# Altium schematic sheet Conn.SchDoc: Connectros
size 420 x 297 mm; Author: UA3REO; CompanyName: Wolf Team; Engineer: UA3REO; DocumentNumber: Connectors FRONT 7'; Revision: 0.1; SheetNumber: 3; SheetTotal: 6
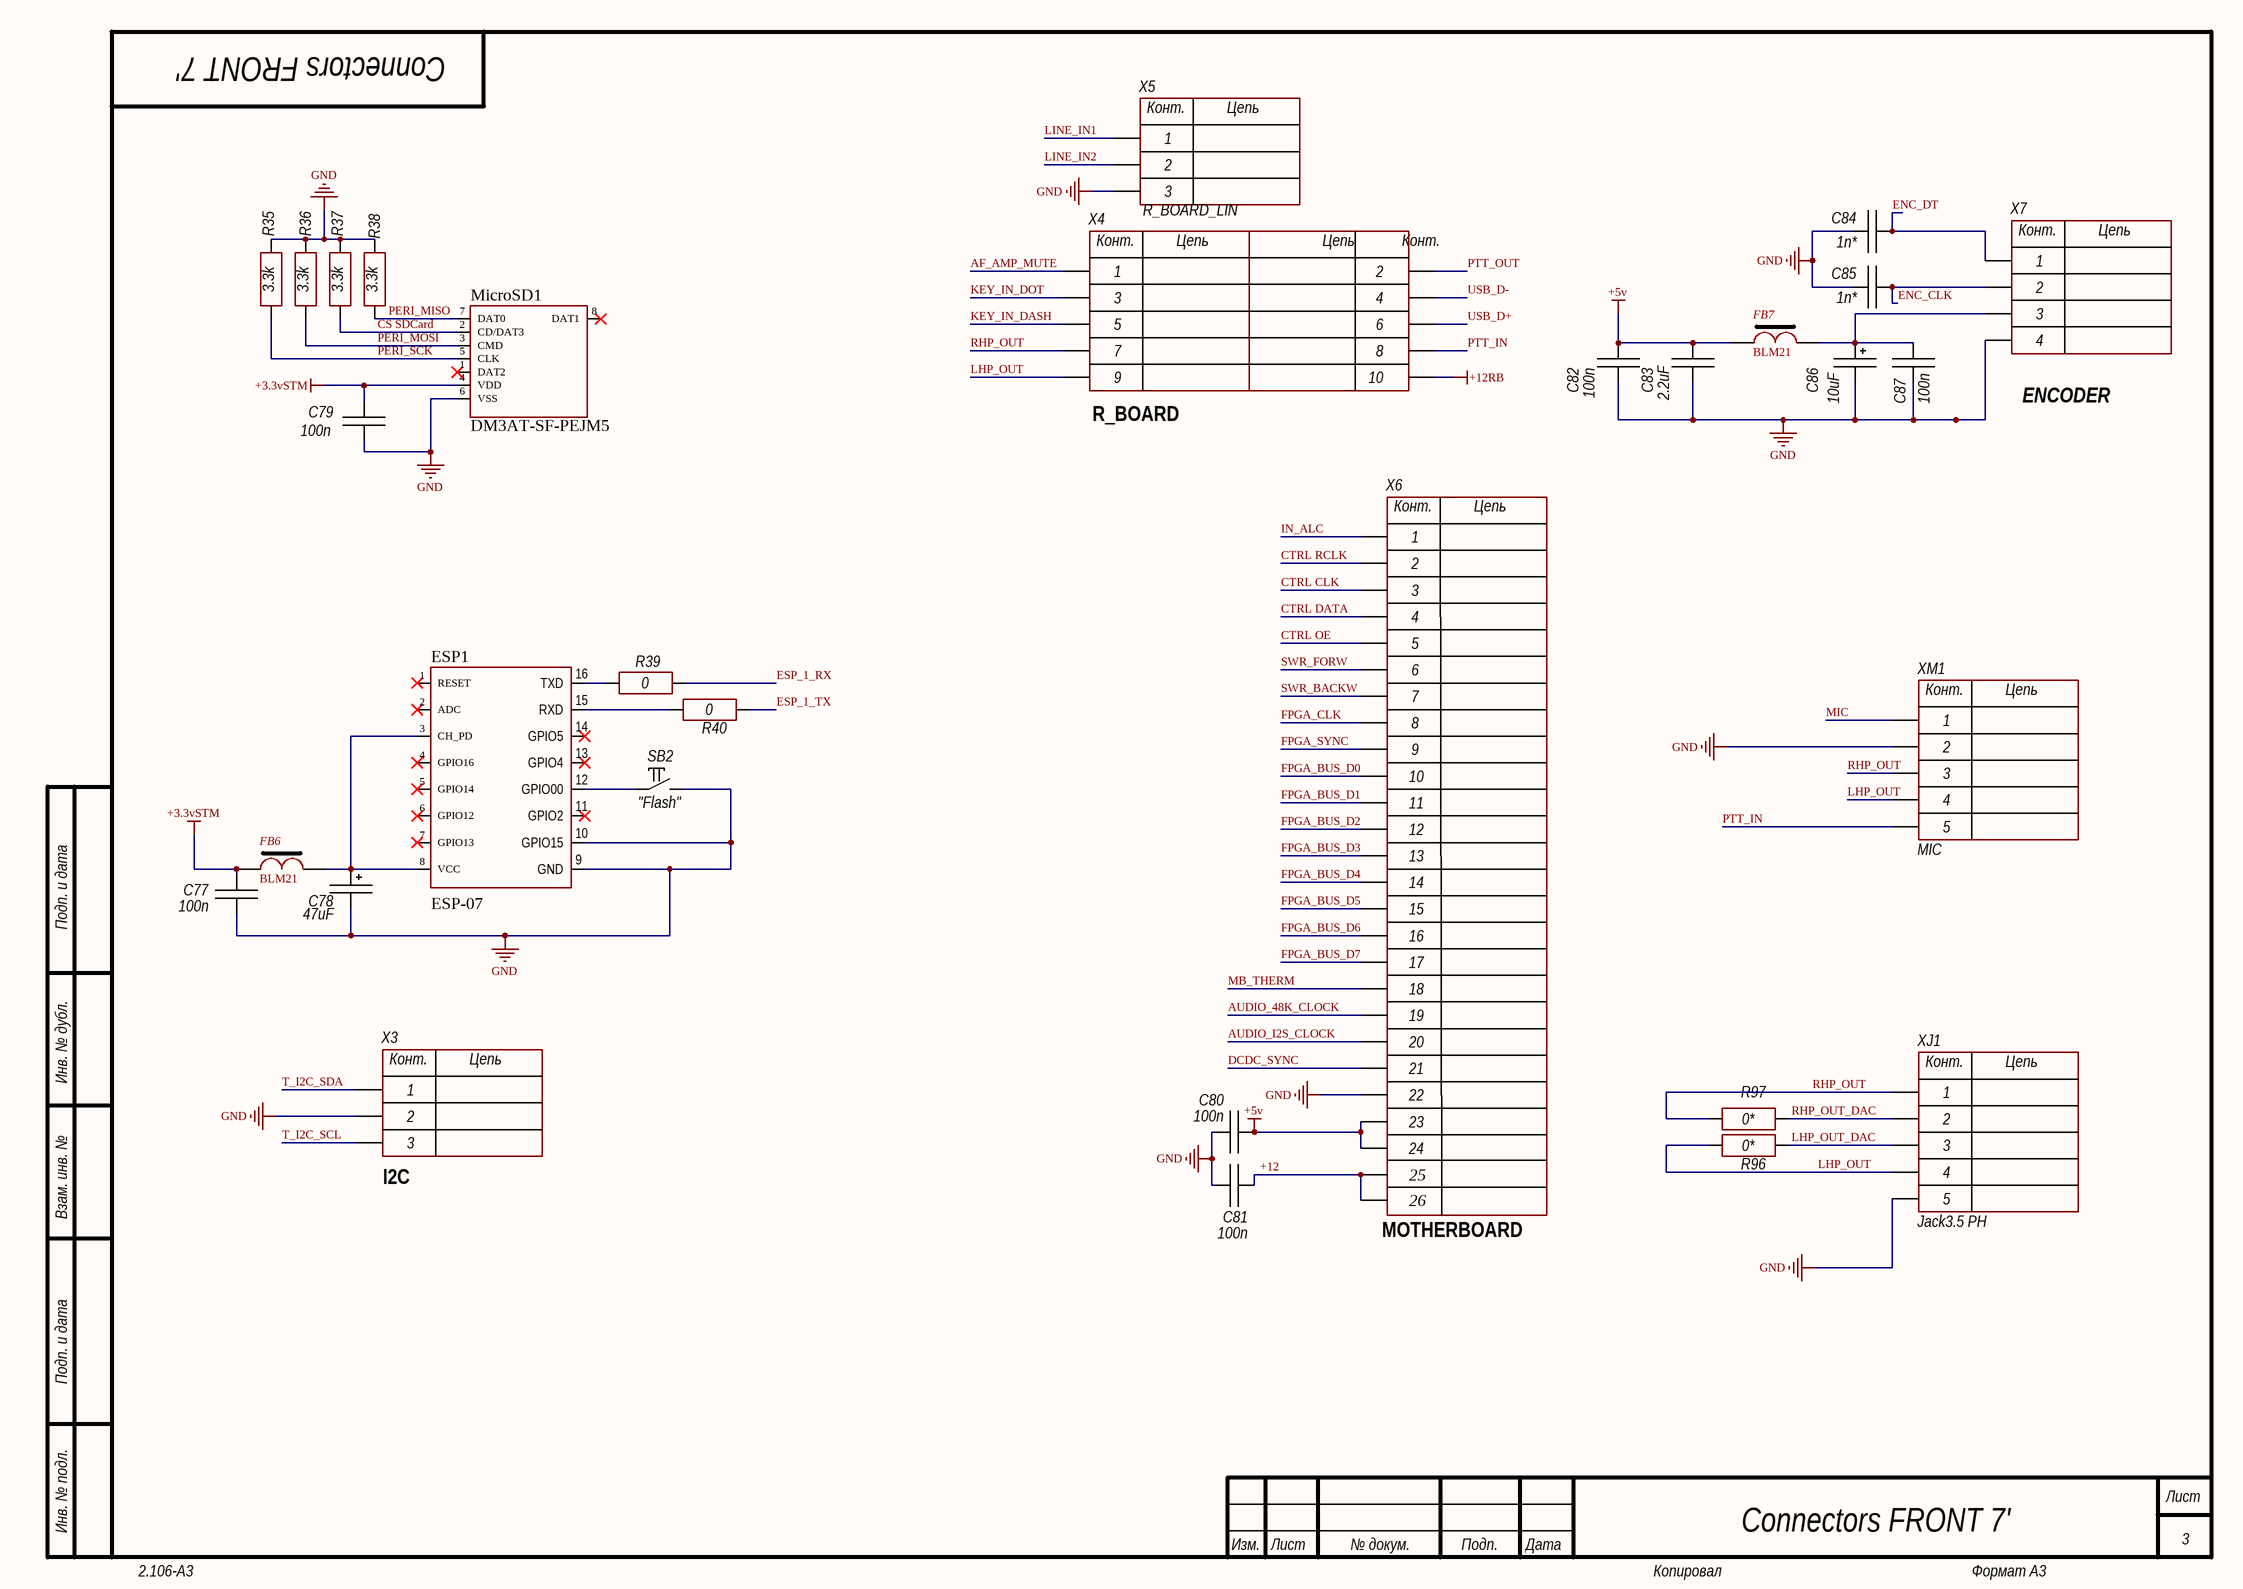
[diagram p0: Conn.SchDoc]

## Parts
C77  100n  [CH0805C]
C78  47uF  [TANTAL_C]
C79  100n  [CH0805C]
C80  100n  [CH0805C]
C81  100n  [CH0805C]
C82  100n  [CH0805C]
C83  2.2uF  [CH0805C]
C84  1n*  [CH0805C]
C85  1n*  [CH0805C]
C86  10uF  [TANTAL_B]
C87  100n  [CH0805C]
ESP1  ESP-07  [ESP8266 ESP-07]
FB6  BLM21  [CH0805L]
FB7  BLM21  [CH0805L]
MicroSD1  DM3AT-SF-PEJM5  [SD-card]
R35  3.3k  [CH0805R]
R36  3.3k  [CH0805R]
R37  3.3k  [CH0805R]
R38  3.3k  [CH0805R]
R39  0  [CH0603R]
R40  0  [CH0603R]
R96  0*  [CH0603R]
R97  0*  [CH0603R]
SB2  "Flash"  [BUT: 6x6 SMD]
X3  I2C  [CON: CWF-3]
X4  R_BOARD  [CON: BH-10]
X5  R_BOARD_LIN  [CON: CWF-3]
X6  MOTHERBOARD  [CON: IDC-26]
X7  ENCODER  [CON: CWF-4]
XJ1  Jack3.5 PH  [CON: PLS-5]
XM1  MIC  [CON: PLS-5]

## Nets
+3.3vSTM: C77.2 C79.2 FB6.2 MicroSD1.4(VDD)
+5v: C80.1 C82.2 C83.2 FB7.2 X6.23 X6.24
+12RB: X4.10
GND: C77.1 C78.2 C79.1 C80.2 C81.2 C82.1 C83.1 C84.1 C85.1 C86.2 C87.1 ESP1.9(GND) ESP1.10(GPIO15) MicroSD1.6(VSS) R35.2 R36.2 R37.2 R38.2 SB2.2 X3.2 X5.3 X6.22 X7.4 XJ1.5 XM1.2
+12: C81.1 X6.25 X6.26
AF_AMP_MUTE: X4.1
AUDIO_48K_CLOCK: X6.19
AUDIO_I2S_CLOCK: X6.20
CS SDCard: MicroSD1.2(CD/DAT3) R37.1
CTRL CLK: X6.3
CTRL DATA: X6.4
CTRL OE: X6.5
CTRL RCLK: X6.2
DCDC_SYNC: X6.21
ENC_CLK: C85.2 X7.2
ENC_DT: C84.2 X7.1
ESP_1_RX: R39.2
ESP_1_TX: R40.2
FPGA_BUS_D0: X6.10
FPGA_BUS_D1: X6.11
FPGA_BUS_D2: X6.12
FPGA_BUS_D3: X6.13
FPGA_BUS_D4: X6.14
FPGA_BUS_D5: X6.15
FPGA_BUS_D6: X6.16
FPGA_BUS_D7: X6.17
FPGA_CLK: X6.8
FPGA_SYNC: X6.9
IN_ALC: X6.1
KEY_IN_DASH: X4.5
KEY_IN_DOT: X4.3
LHP_OUT: R96.1 X4.9 XJ1.4 XM1.4
LHP_OUT_DAC: R96.2 XJ1.3
LINE_IN1: X5.1
LINE_IN2: X5.2
MB_THERM: X6.18
MIC: XM1.1
PERI_MISO: MicroSD1.7(DAT0) R38.1
PERI_MOSI: MicroSD1.3(CMD) R36.1
PERI_SCK: MicroSD1.5(CLK) R35.1
PTT_IN: X4.8 XM1.5
PTT_OUT: X4.2
RHP_OUT: R97.1 X4.7 XJ1.1 XM1.3
RHP_OUT_DAC: R97.2 XJ1.2
SWR_BACKW: X6.7
SWR_FORW: X6.6
T_I2C_SCL: X3.3
T_I2C_SDA: X3.1
USB_D+: X4.6
USB_D-: X4.4
NetC78_1: C78.1 ESP1.3(CH_PD) ESP1.8(VCC) FB6.1
NetC86_1: C86.1 C87.2 FB7.1 X7.3
NetESP1_12: ESP1.12(GPIO00) SB2.1
NetESP1_15: ESP1.15(RXD) R40.1
NetESP1_16: ESP1.16(TXD) R39.1

Not connected (* = marked no-connect by the designer): ESP1 1(RESET)* 2(ADC)* 4(GPIO16)* 5(GPIO14)* 6(GPIO12)* 7(GPIO13)* 11(GPIO2)* 13(GPIO4)* 14(GPIO5)*; MicroSD1 1(DAT2)* 8(DAT1)*

## Notes on the sheet
- Подп. и дата
- Инв. № дубл.
- Взам. инв. №
- Инв. № подл.
- Изм.
- Лист
- № докум.
- Подп.
- Дата
- 2.106-A3
- Копировал
- Формат А3
- (in symbol 3-Connector) Конт.; Цепь
- (in symbol 4-Connector) Конт.; Цепь
- (in symbol 5-Connector) Конт.; Цепь
- (in symbol 10(2)-Connector) Конт.; Цепь
- (in symbol 26-Connector) Конт.; Цепь

## Library data of the parts
C77 C79-C85 C87 = Capacitor: Manufacturer: *; Model: *; HelpURL: *; ComponentKind: *; Value: *
C78 C86 = TantalCap: Manufacturer: *; Model: *; HelpURL: *; ComponentKind: *; Value: *
FB6 FB7 = FB-1
MicroSD1 = MicroSD
R35-R40 R96 R97 = Resistor: Manufacturer: *; Model: *; HelpURL: *; ComponentKind: *; Value: *
SB2 = Tactile switches: 6x6 mm; Manufacturer: *; Model: *; HelpURL: *; ComponentKind: *
X3 X5 = 3-Connector: Model: *; Manufacturer: *; HelpURL: *; ComponentKind: *
X4 = 10(2)-Connector: Model: *; Manufacturer: *; HelpURL: *; ComponentKind: *
X6 = 26-Connector: Model: *; Manufacturer: *; HelpURL: *; ComponentKind: *
X7 = 4-Connector: Model: *; Manufacturer: *; HelpURL: *; ComponentKind: *
XJ1 XM1 = 5-Connector: Model: *; Manufacturer: *; HelpURL: *; ComponentKind: *